# EAGLE schematic MainBoard_Simple (EAGLE 7.7.0)
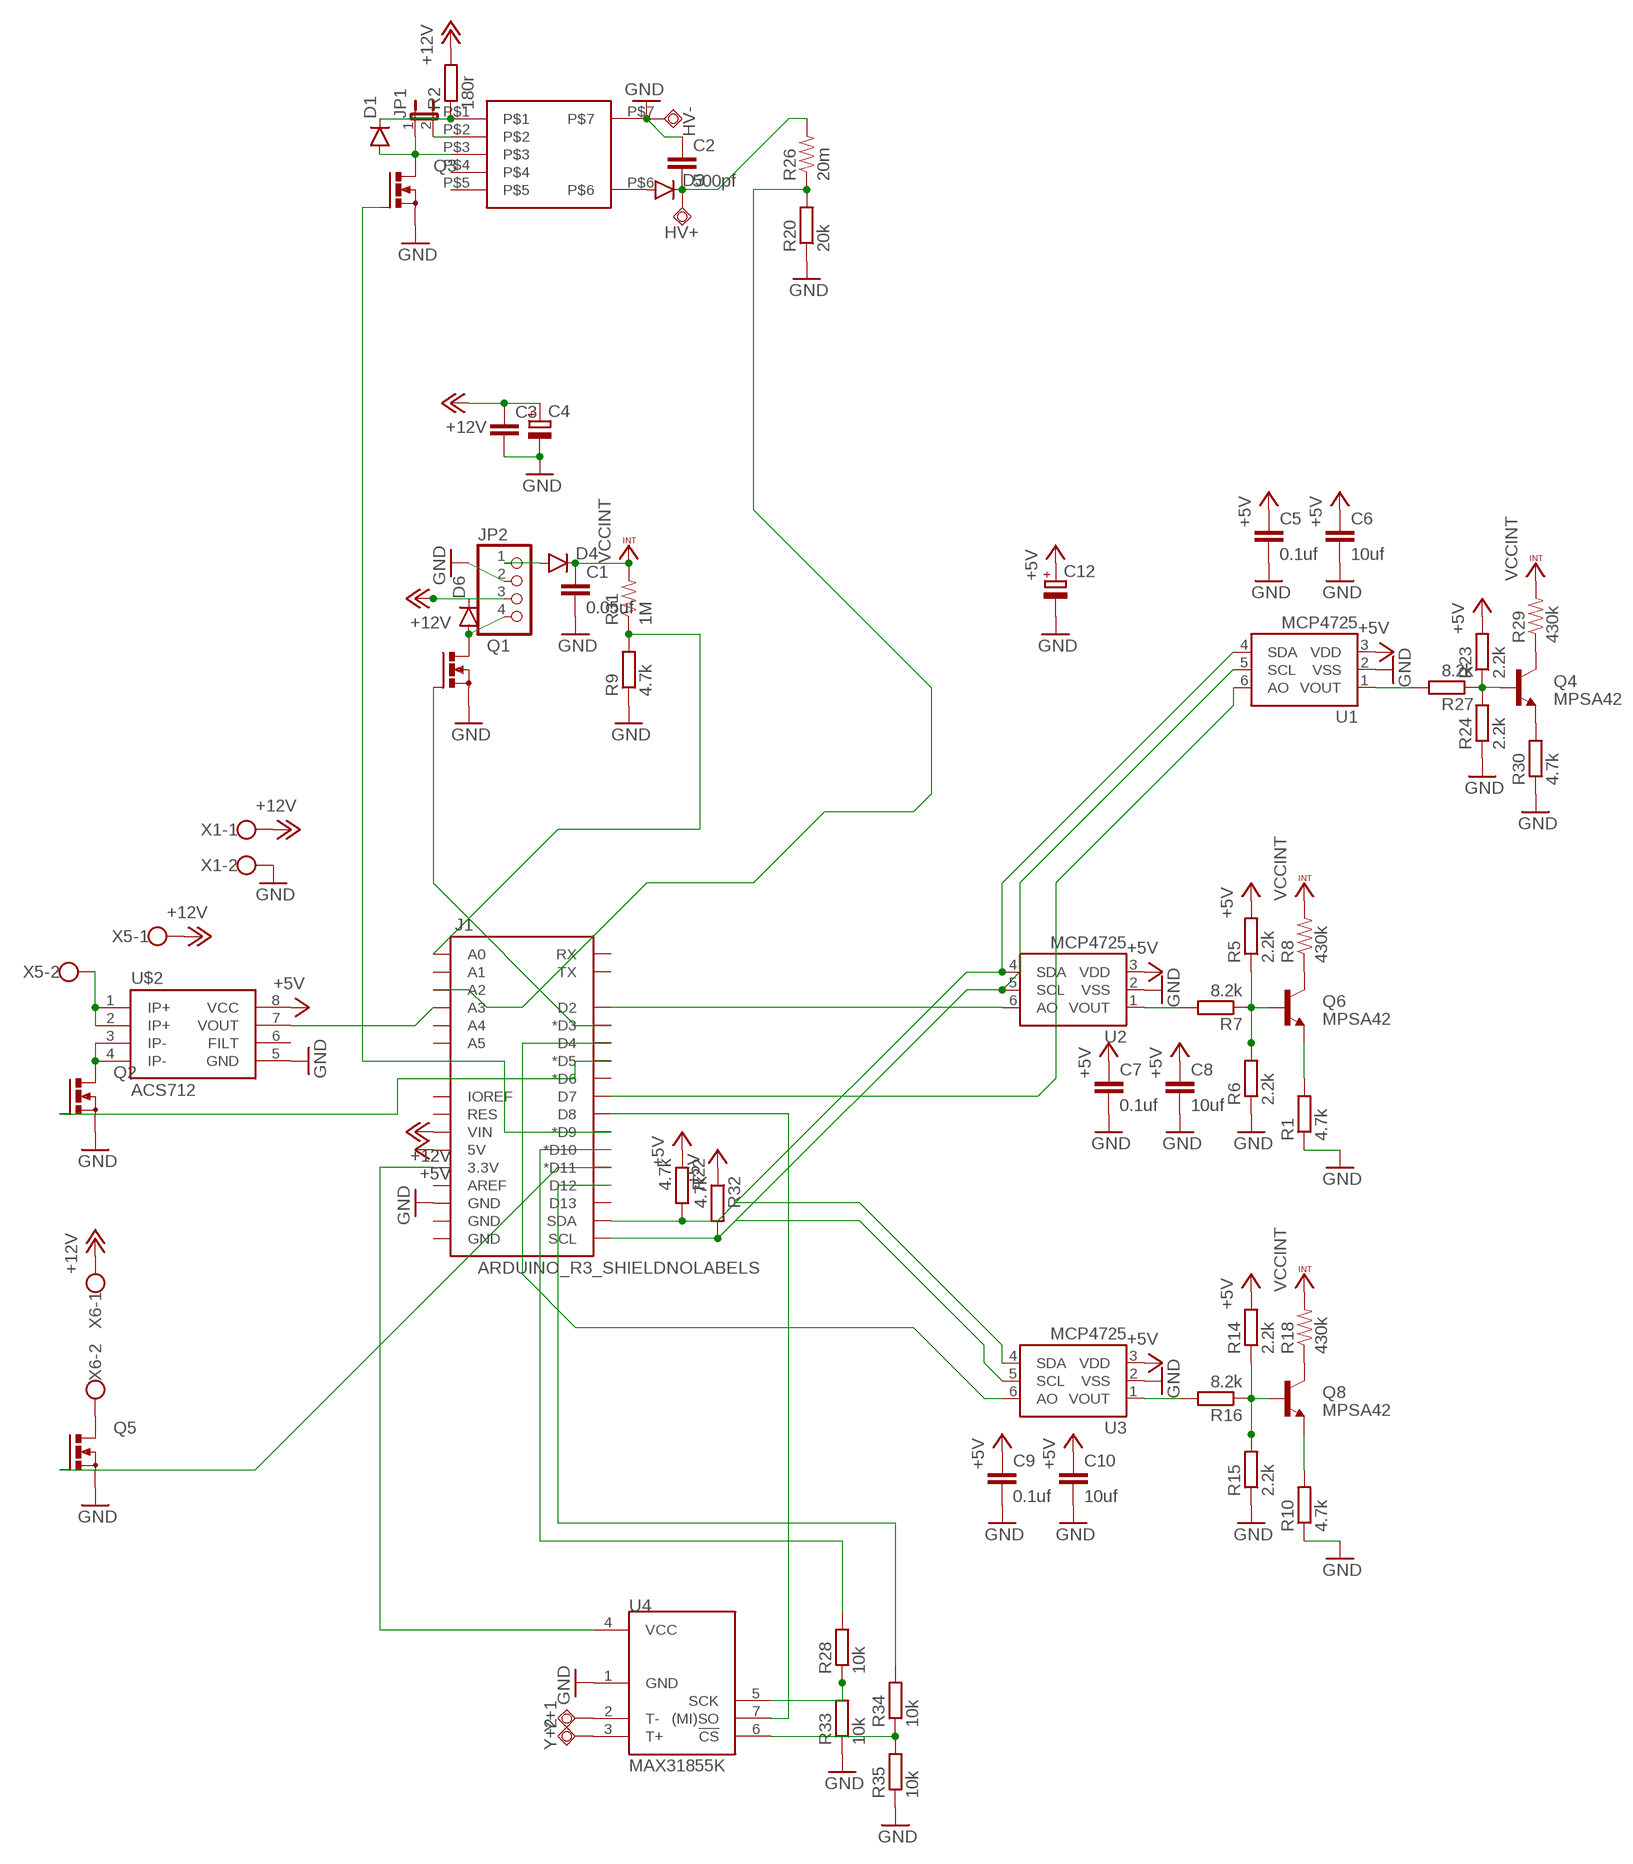
[diagram p0: schematic, sheet 1]

## Parts
C1  0.05uf  CC1206  [C1206]
C2  500pf  CC1206  [C1206]
C3  C-EUC0603  [C0603]
C4  CPOL-EUTAP5-60  [TAP5-60]
C5  0.1uf  C-EUC0603  [C0603]
C6  10uf  C-EUC0603  [C0603]
C7  0.1uf  C-EUC0603  [C0603]
C8  10uf  C-EUC0603  [C0603]
C9  0.1uf  C-EUC0603  [C0603]
C10  10uf  C-EUC0603  [C0603]
C12  CPOL-EUTAP5-60  [TAP5-60]
D1  DIODESOD123  [SOD-123]
D3  DIODEPTH  [DIODE-1N4001]
D4  DIODESOD123  [SOD-123]
D6  DIODESOD123  [SOD-123]
HV+  TPSQPAD1-13  [P1-13]
HV-  TPSQPAD1-13  [P1-13]
J1  ARDUINO_R3_SHIELDNOLABELS  [UNO_R3_SHIELD_NOLABELS]
JP1  JUMPER-2SMD-NO  [SJ_2S-NO]
JP2  PINHD-1X4  [1X04]
Q1  N-MOSFET-SO8S  [SO-08]
Q2  N-MOSFET-SO8S  [SO-08]
Q3  N-MOSFET-SO8S  [SO-08]
Q4  MPSA42  TRANSISTOR_NPNMPSA42  [SOT23-3]
Q5  N-MOSFET-SO8S  [SO-08]
Q6  MPSA42  TRANSISTOR_NPNMPSA42  [SOT23-3]
Q8  MPSA42  TRANSISTOR_NPNMPSA42  [SOT23-3]
R1  4.7k  R-EU_R0603  [R0603]
R2  180r  R-EU_R0603  [R0603]
R5  2.2k  R-EU_R0603  [R0603]
R6  2.2k  R-EU_R0603  [R0603]
R7  8.2k  R-EU_R0603  [R0603]
R8  430k  RESISTOR1206  [1206]
R9  4.7k  R-EU_R0603  [R0603]
R10  4.7k  R-EU_R0603  [R0603]
R14  2.2k  R-EU_R0603  [R0603]
R15  2.2k  R-EU_R0603  [R0603]
R16  8.2k  R-EU_R0603  [R0603]
R18  430k  RESISTOR1206  [1206]
R20  20k  R-EU_R0603  [R0603]
R22  4.7k  R-EU_R0603  [R0603]
R23  2.2k  R-EU_R0603  [R0603]
R24  2.2k  R-EU_R0603  [R0603]
R26  20m  RESISTORPTH-1/4W  [AXIAL-0.4]
R27  8.2k  R-EU_R0603  [R0603]
R28  10k  R-EU_R0603  [R0603]
R29  430k  RESISTOR1206  [1206]
R30  4.7k  R-EU_R0603  [R0603]
R31  1M  RESISTOR1206  [1206]
R32  4.7k  R-EU_R0603  [R0603]
R33  10k  R-EU_R0603  [R0603]
R34  10k  R-EU_R0603  [R0603]
R35  10k  R-EU_R0603  [R0603]
U1  MCP4725  MCP4725SOT-23  [SOT23-6]
U2  MCP4725  MCP4725SOT-23  [SOT23-6]
U3  MCP4725  MCP4725SOT-23  [SOT23-6]
U4  MAX31855K  [SOIC8]
U$2  ACS712  [SO08]
U$3  CTX  [CTX]
X1  W237-102  [W237-102]
X5  W237-102  [W237-102]
X6  W237-102  [W237-102]
Y+1  TPSQPAD1-13  [P1-13]
Y+2  TPSQPAD1-13  [P1-13]

## Nets
+5V: C5.1 C6.1 C7.1 C8.1 C9.1 C10.1 C12.+ J1.5V R5.2 R14.2 R22.1 R23.2 R32.1 U1.3(VDD) U2.3(VDD) U3.3(VDD) U$2.8(VCC)
+12V: C3.1 C4.+ D6.C J1.VIN JP2.3 R2.2 X1.1 X5.1 X6.1
GND: C1.2 C2.1 C3.2 C4.- C5.2 C6.2 C7.2 C8.2 C9.2 C10.2 C12.- HV-.TP J1.GND@2(GND) JP2.2 Q1.1(S) Q1.2(S) Q1.3(S) Q2.1(S) Q2.2(S) Q2.3(S) Q3.1(S) Q3.2(S) Q3.3(S) Q5.1(S) Q5.2(S) Q5.3(S) R1.1 R6.1 R9.1 R10.1 R15.1 R20.1 R24.1 R30.1 R33.1 R35.1 U1.2(VSS) U2.2(VSS) U3.2(VSS) U4.1(GND) U$2.5(GND) U$3.P$7 X1.2
N$1 [med]: Q6.3(C) R8.1
N$2: D4.A JP2.1
N$3: R7.2 U2.1(VOUT)
N$4: Q6.2(E) R1.2
N$5: D6.A JP2.4 Q1.5(D) Q1.6(D) Q1.7(D) Q1.8(D)
N$8: Q6.1(B) R5.1 R6.2 R7.1
N$9: Q4.2(E) R30.2
N$10: J1.D3(*D3) Q1.4(G)
N$11: Q8.2(E) R10.2
N$13: J1.SDA R22.2 U1.4(SDA) U2.4(SDA) U3.4(SDA)
N$14: Q8.1(B) R14.1 R15.2 R16.1
N$16 [med]: Q8.3(C) R18.1
N$17: R16.2 U3.1(VOUT)
N$18: J1.D2 U2.6(AO)
N$19: J1.D4 U3.6(AO)
N$20: J1.A0 R9.2 R31.1
N$23: Q2.5(D) Q2.6(D) Q2.7(D) Q2.8(D) U$2.3(IP-) U$2.4(IP-)
N$24: U$2.1(IP+) U$2.2(IP+) X5.2
N$25: J1.D5(*D5) Q2.4(G)
N$26: D1.A JP1.1 Q3.5(D) Q3.6(D) Q3.7(D) Q3.8(D) U$3.P$3
N$27: JP1.2 U$3.P$2
N$28: D1.C R2.1 U$3.P$1
N$29 [hv]: D3.A U$3.P$6
N$30 [hv]: C2.2 D3.C HV+.TP R26.P$2
N$31: R28.1 R33.2 U4.5(SCK)
N$33: Q4.1(B) R23.1 R24.2 R27.1
N$34: R27.2 U1.1(VOUT)
N$35: J1.SCL R32.2 U1.5(SCL) U2.5(SCL) U3.5(SCL)
N$36: Q4.3(C) R29.1
N$37: R34.1 R35.2 U4.6(!CS)
N$38: J1.D9(*D9) Q3.4(G)
N$39: J1.D10(*D10) R28.2
N$40: J1.A2 R20.2 R26.P$1
N$41 [med]: Q5.5(D) Q5.6(D) Q5.7(D) Q5.8(D) X6.2
N$42: J1.D11(*D11) Q5.4(G)
N$43: J1.A3 U$2.7(VOUT)
N$44: J1.D12 R34.2
N$45: J1.D7 U1.6(AO)
N$46: J1.D8 U4.7((MI)SO)
N$47: U4.2(T-) Y+1.TP
N$48: U4.3(T+) Y+2.TP
N$49: J1.3.3V U4.4(VCC)
VCCINT [med]: C1.1 D4.C R8.2 R18.2 R29.2 R31.2
Unconnected: J1.A1 J1.A4 J1.A5 J1.AREF J1.D6(*D6) J1.D13 J1.GND@0(GND) J1.GND@1(GND) J1.IOREF J1.RES J1.RX J1.TX U$2.6(FILT) U$3.P$4 U$3.P$5

## Library data of the parts
C1 C2 = eagle-ltspice:C: CAPACITOR, European symbol; SPICEMODEL: NONE; SPICEPREFIX: C
C3 C5-C10 = rcl:C-EU: CAPACITOR, European symbol
C4 C12 = rcl:CPOL-EU: POLARIZED CAPACITOR, European symbol
D1 D3 D4 D6 = SparkFun-DiscreteSemi:DIODE: Diode These are standard reverse protection diodes and small signal diodes. SMA package can handle up to about 1A. SOD-323 can handle about 200mA. What the SOD-323 package when ordering, there are some mfgs out there that are 5-pin packages.
HV+ HV- Y+1 Y+2 = testpad:TPSQ: Test pad
J1 = SparkFun-Boards:ARDUINO_R3_SHIELD: Shield form compatible with the Arduino Uno R3.
JP1 = SparkFun-Retired:JUMPER-2: Jumper Basic 0.1" spaced jumper. Use with breakaway headers.
JP2 = pinhead:PINHD-1X4: PIN HEADER
Q1-Q3 Q5 = transistor-power:N-MOSFET-SO8: N-Channel MOSFET Example: FDS7760A; N-Channel Logic Level PowerTrench® MOSFET FDS2572; N-Channel UltraFET® Trench MOSFET Source: www.fairchildsemi.com
Q4 Q6 Q8 = SparkFun-DiscreteSemi:TRANSISTOR_NPN: Generic NPN BJT MMBT2222A - TRANS-08049 (SOT-23, 1A 40V) MPSA42 - TRANS-09116 (SOT-23, 500mA 300V) MMBT5088LT1G - TRANS-11160 (SOT-23, 50 mA 30V) BC547 - COM-08928 <http://www.sparkfun.com/products/8928> (TO-92 45V 100mA) (1.Collector 2.Base 3.Emitter) 2N3904 - COM-00521 <http://www.sparkfun.com/products/521> (TO-92 40V 200mA) (1.Emitter 2.Base 3.Collector) P2N2222A - COM-12852 <http://www.sparkfun.com/products/12852> (TO-92 40V 600mA) (1.Collector 2.Base 3.Emitter); PROD_ID: TRANS-09116
R1 R2 R5-R7 R9 R10 R14-R16 R20 R22-R24 R27 R28 R30 R32-R35 = rcl:R-EU_: RESISTOR, European symbol
R8 R18 R26 R29 R31 = SparkFun-Resistors:RESISTOR: Resistor Basic schematic elements and footprints for 0603, 1206, and PTH resistors.
U1-U3 = SparkFun-AnalogIC:MCP4725: Microchip 12-bit I2C DAC, SOT23-6; PROD_ID: IC-08886
U4 = SparkFun-AnalogIC:MAX31855K: Cold-Junction-Compensated K-Thermocoupleto-Digital Converter (-270°C to +1800°C) The MAX31855K performs cold-junction compensation and digitizes the signal from a type-K thermocouple. The data is output in a 14-bit resolution, SPI™-compatible, read-only format. This converter resolves temperatures to 0.25°C, allows readings as high as +1800°C and as low as -270°C, and exhibits thermocouple accuracy of ±2°C for temperatures ranging from -200°C to +700°C for K-type thermocouples.
U$2 = SparkFun-AnalogIC:ACS712: Hall-effect-based isolated linear current sensor; PROD_ID: IC-08964
U$3 = TheLibrary:CTX
X1 X5 X6 = con-wago-500:W237-102: WAGO SCREW CLAMP; MPN: 237-102; OC_FARNELL: unknown; OC_NEWARK: 70K9898

## Net classes
1 med: width 0.254 mm, clearance 1.27 mm
2 hv: width 0.254 mm, clearance 3.81 mm